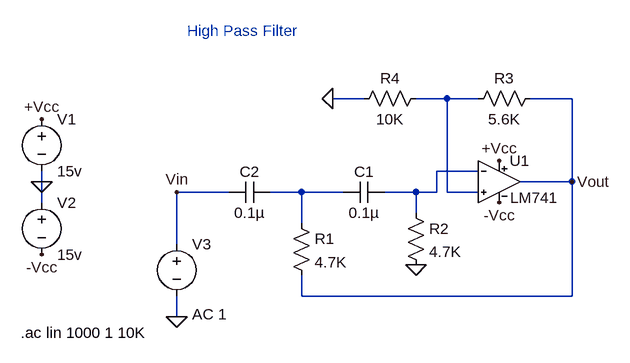
[diagram p0: schematic HPF.asc]
HPF.asc, the LTspice schematic file:
Version 4
SHEET 1 880 680
WIRE 208 48 160 48
WIRE 336 48 288 48
WIRE 384 48 336 48
WIRE 528 48 464 48
WIRE 384 160 320 160
WIRE -288 176 -288 160
WIRE 528 176 528 48
WIRE 528 176 448 176
WIRE 0 192 -80 192
WIRE 112 192 64 192
WIRE 176 192 112 192
WIRE 288 192 240 192
WIRE 320 192 320 160
WIRE 320 192 288 192
WIRE 336 192 336 48
WIRE 384 192 336 192
WIRE -288 208 -288 176
WIRE 288 224 288 192
WIRE 112 240 112 192
WIRE -80 272 -80 192
WIRE 112 352 112 320
WIRE 528 352 528 176
WIRE 528 352 112 352
WIRE -80 384 -80 352
FLAG -288 176 0
FLAG -288 80 +Vcc
FLAG -288 288 -Vcc
FLAG -80 384 0
FLAG 160 48 0
FLAG -80 192 Vin
FLAG 288 304 0
FLAG 416 144 +Vcc
FLAG 416 208 -Vcc
FLAG 528 176 Vout
SYMBOL voltage -288 64 R0
WINDOW 123 0 0 Left 0
WINDOW 39 0 0 Left 0
SYMATTR InstName V1
SYMATTR Value 15v
SYMBOL voltage -288 192 R0
WINDOW 123 0 0 Left 0
WINDOW 39 0 0 Left 0
SYMATTR InstName V2
SYMATTR Value 15v
SYMBOL voltage -80 256 R0
WINDOW 123 24 124 Left 2
WINDOW 39 0 0 Left 0
SYMATTR Value2 AC 1
SYMATTR InstName V3
SYMATTR Value ""
SYMBOL res 480 32 R90
WINDOW 0 0 56 VBottom 2
WINDOW 3 32 56 VTop 2
SYMATTR InstName R3
SYMATTR Value 5.6K
SYMBOL res 304 32 R90
WINDOW 0 0 56 VBottom 2
WINDOW 3 32 56 VTop 2
SYMATTR InstName R4
SYMATTR Value 10K
SYMBOL res 96 224 R0
SYMATTR InstName R1
SYMATTR Value 4.7K
SYMBOL res 272 208 R0
SYMATTR InstName R2
SYMATTR Value 4.7K
SYMBOL cap 240 176 R90
WINDOW 0 0 32 VBottom 2
WINDOW 3 32 32 VTop 2
SYMATTR InstName C1
SYMATTR Value 0.1µ
SYMBOL cap 64 176 R90
WINDOW 0 0 32 VBottom 2
WINDOW 3 32 32 VTop 2
SYMATTR InstName C2
SYMATTR Value 0.1µ
SYMBOL LM741 416 112 R0
SYMATTR InstName U1
TEXT -64 -56 Left 2 ;High Pass Filter
TEXT -320 408 Left 2 !.ac lin 1000 1 10K

The netlist it stands for:
* HPF.asc
V1 +Vcc 0 15v
V2 0 -Vcc 15v
V3 Vin 0 AC 1
R3 Vout N001 5.6K
R4 N001 0 10K
R1 N003 Vout 4.7K
R2 N002 0 4.7K
C1 N002 N003 0.1µ
C2 N003 Vin 0.1µ
XU1 N001 N002 +Vcc -Vcc Vout LM741  ; pins In+ In- V+ V- OUT
* High Pass Filter
.ac lin 1000 1 10K
.lib LM741.lib
.backanno
.end